# Altium schematic sheet Motortreiber.SchDoc
size A4; SheetNumber: 4; SheetTotal: 4
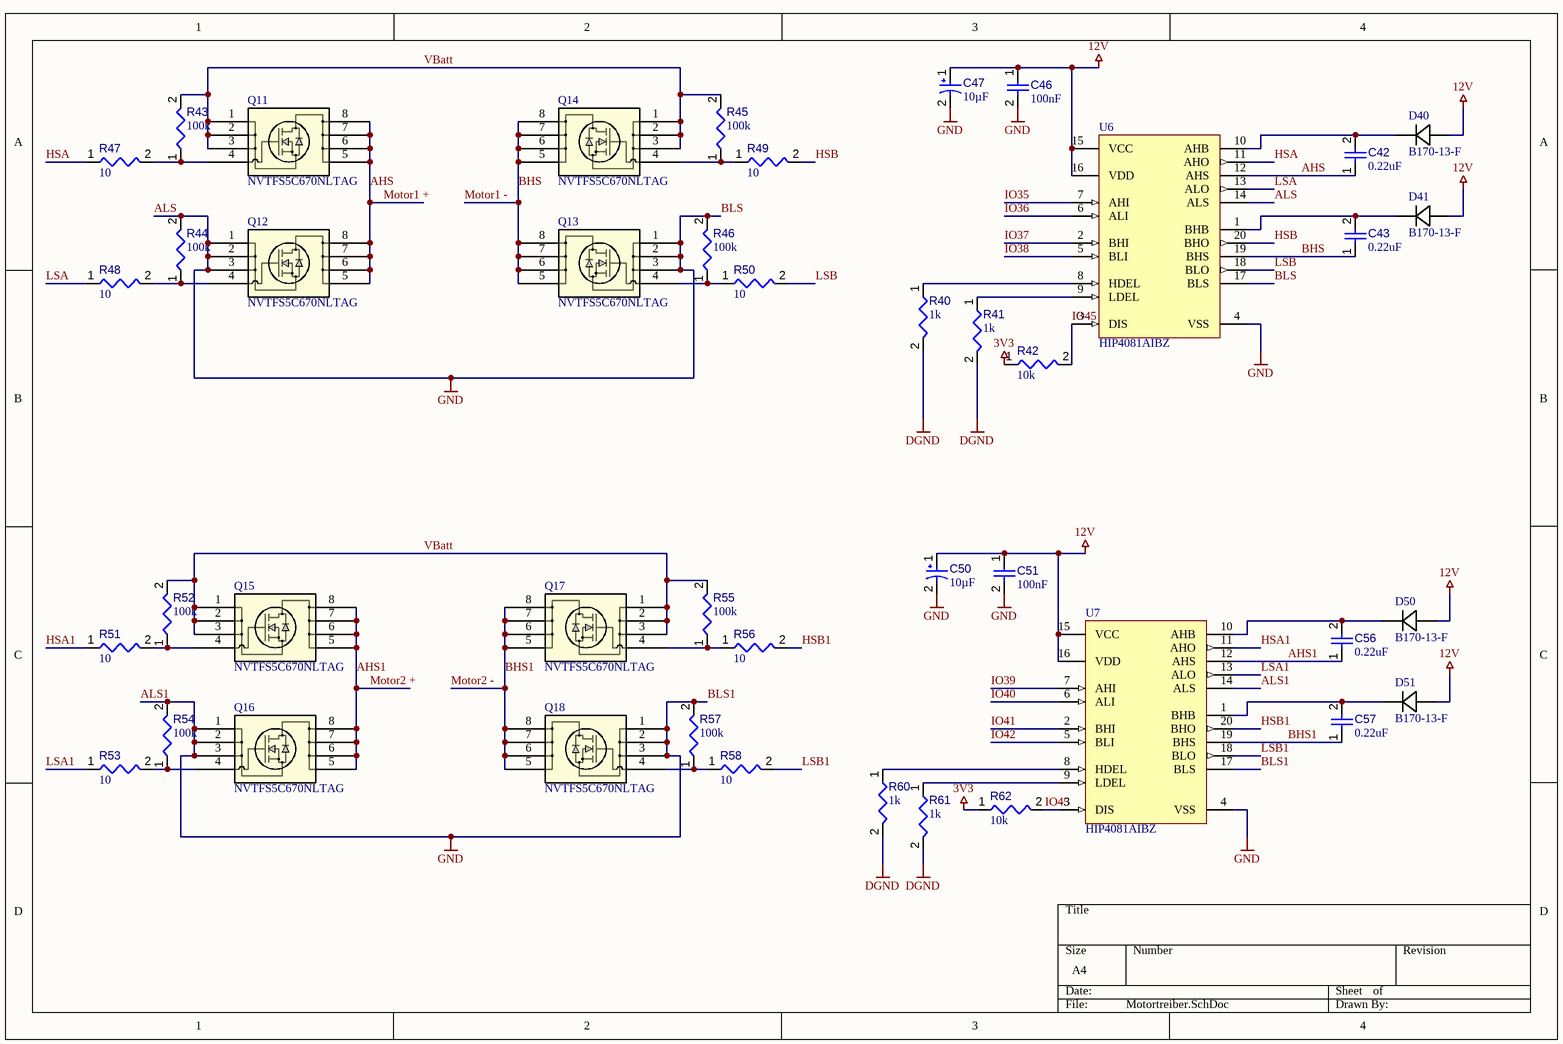
[diagram p0: Motortreiber.SchDoc]

## Parts
C42  value 0.22uF  [CAPC1608X90X40NL10T20]  (hidden comment: Capacitor 100 nF +/-10% 50 V 0603)
C43  value 0.22uF  [CAPC1608X90X40NL10T20]  (hidden comment: Capacitor 100 nF +/-10% 50 V 0603)
C46  value 100nF  [CAPC1608X90X40NL10T20]  (hidden comment: Capacitor 100 nF +/-10% 50 V 0603)
C47  value 10µF  [CAPPR55-200-1100X500X1200]  (hidden comment: ECA1HM100)
C50  value 10µF  [CAPPR55-200-1100X500X1200]  (hidden comment: ECA1HM100)
C51  value 100nF  [CAPC1608X90X40NL10T20]  (hidden comment: Capacitor 100 nF +/-10% 50 V 0603)
C56  value 0.22uF  [CAPC1608X90X40NL10T20]  (hidden comment: Capacitor 100 nF +/-10% 50 V 0603)
C57  value 0.22uF  [CAPC1608X90X40NL10T20]  (hidden comment: Capacitor 100 nF +/-10% 50 V 0603)
D40  B170-13-F  [SMA_DIO]
D41  B170-13-F  [SMA_DIO]
D50  B170-13-F  [SMA_DIO]
D51  B170-13-F  [SMA_DIO]
Q11  NVTFS5C670NLTAG  [WDFN8_511AB_ONS]
Q12  NVTFS5C670NLTAG  [WDFN8_511AB_ONS]
Q13  NVTFS5C670NLTAG  [WDFN8_511AB_ONS]
Q14  NVTFS5C670NLTAG  [WDFN8_511AB_ONS]
Q15  NVTFS5C670NLTAG  [WDFN8_511AB_ONS]
Q16  NVTFS5C670NLTAG  [WDFN8_511AB_ONS]
Q17  NVTFS5C670NLTAG  [WDFN8_511AB_ONS]
Q18  NVTFS5C670NLTAG  [WDFN8_511AB_ONS]
R40  value 1k  [RESC1608X55X25ML10T15]  (hidden comment: Resistor 1k +/-1% 0603 100 mW)
R41  value 1k  [RESC1608X55X25ML10T15]  (hidden comment: Resistor 1k +/-1% 0603 100 mW)
R42  value 10k  [RESC1608X55X25ML10T15]  (hidden comment: Resistor 10k +/-1% 0603 100 mW)
R43  value 100k  [RESC1608X55X25ML10T15]  (hidden comment: Resistor 100k +/-1% 0603 100 mW)
R44  value 100k  [RESC1608X55X25ML10T15]  (hidden comment: Resistor 100k +/-1% 0603 100 mW)
R45  value 100k  [RESC1608X55X25ML10T15]  (hidden comment: Resistor 100k +/-1% 0603 100 mW)
R46  value 100k  [RESC1608X55X25ML10T15]  (hidden comment: Resistor 100k +/-1% 0603 100 mW)
R47  value 10  [RESC1608X55X25ML10T15]  (hidden comment: Resistor 100k +/-1% 0603 100 mW)
R48  value 10  [RESC1608X55X25ML10T15]  (hidden comment: Resistor 100k +/-1% 0603 100 mW)
R49  value 10  [RESC1608X55X25ML10T15]  (hidden comment: Resistor 100k +/-1% 0603 100 mW)
R50  value 10  [RESC1608X55X25ML10T15]  (hidden comment: Resistor 100k +/-1% 0603 100 mW)
R51  value 10  [RESC1608X55X25ML10T15]  (hidden comment: Resistor 100k +/-1% 0603 100 mW)
R52  value 100k  [RESC1608X55X25ML10T15]  (hidden comment: Resistor 100k +/-1% 0603 100 mW)
R53  value 10  [RESC1608X55X25ML10T15]  (hidden comment: Resistor 100k +/-1% 0603 100 mW)
R54  value 100k  [RESC1608X55X25ML10T15]  (hidden comment: Resistor 100k +/-1% 0603 100 mW)
R55  value 100k  [RESC1608X55X25ML10T15]  (hidden comment: Resistor 100k +/-1% 0603 100 mW)
R56  value 10  [RESC1608X55X25ML10T15]  (hidden comment: Resistor 100k +/-1% 0603 100 mW)
R57  value 100k  [RESC1608X55X25ML10T15]  (hidden comment: Resistor 100k +/-1% 0603 100 mW)
R58  value 10  [RESC1608X55X25ML10T15]  (hidden comment: Resistor 100k +/-1% 0603 100 mW)
R60  value 1k  [RESC1608X55X25ML10T15]  (hidden comment: Resistor 1k +/-1% 0603 100 mW)
R61  value 1k  [RESC1608X55X25ML10T15]  (hidden comment: Resistor 1k +/-1% 0603 100 mW)
R62  value 10k  [RESC1608X55X25ML10T15]  (hidden comment: Resistor 10k +/-1% 0603 100 mW)
U6  HIP4081AIBZ  [M20_3_MFG]
U7  HIP4081AIBZ  [M20_3_MFG]

## Nets
3V3: R42.1 R62.1
12V: C46.1 C47.1 C50.1 C51.1 D40.2 D41.2 D50.2 D51.2 U6.15(VCC) U6.16(VDD) U7.15(VCC) U7.16(VDD)
ALS: C46.2 C47.2 C50.2 C51.2 Q12.1 Q12.2 Q12.3 Q13.1 Q13.2 Q13.3 Q16.1 Q16.2 Q16.3 Q18.1 Q18.2 Q18.3 R44.2 R46.2 R54.2 R57.2 U6.4(VSS) U6.14(ALS) U6.17(BLS) U7.4(VSS) U7.14(ALS) U7.17(BLS)  [also labelled ALS1, BLS, BLS1, GND]
DGND: R40.2 R41.2 R60.2 R61.2
AHS: C42.1 Q11.5 Q11.6 Q11.7 Q11.8 Q12.5 Q12.6 Q12.7 Q12.8 U6.12(AHS)  [also labelled Motor1 +]
AHS1: C56.1 Q15.5 Q15.6 Q15.7 Q15.8 Q16.5 Q16.6 Q16.7 Q16.8 U7.12(AHS)  [also labelled Motor2 +]
BHS: C43.1 Q13.5 Q13.6 Q13.7 Q13.8 Q14.5 Q14.6 Q14.7 Q14.8 U6.19(BHS)  [also labelled Motor1 -]
BHS1: C57.1 Q17.5 Q17.6 Q17.7 Q17.8 Q18.5 Q18.6 Q18.7 Q18.8 U7.19(BHS)  [also labelled Motor2 -]
HSA: R47.1 U6.11(AHO)
HSA1: R51.1 U7.11(AHO)
HSB: R49.2 U6.20(BHO)
HSB1: R56.2 U7.20(BHO)
IO35: U6.7(AHI)
IO36: U6.6(ALI)
IO37: U6.2(BHI)
IO38: U6.5(BLI)
IO39: U7.7(AHI)
IO40: U7.6(ALI)
IO41: U7.2(BHI)
IO42: U7.5(BLI)
IO45: R42.2 R62.2 U6.3(DIS) U7.3(DIS)
LSA: R48.1 U6.13(ALO)
LSA1: R53.1 U7.13(ALO)
LSB: R50.2 U6.18(BLO)
LSB1: R58.2 U7.18(BLO)
VBatt: Q11.1 Q11.2 Q11.3 Q14.1 Q14.2 Q14.3 Q15.1 Q15.2 Q15.3 Q17.1 Q17.2 Q17.3 R43.2 R45.2 R52.2 R55.2
NetC42_2: C42.2 D40.1 U6.10(AHB)
NetC43_2: C43.2 D41.1 U6.1(BHB)
NetC56_2: C56.2 D50.1 U7.10(AHB)
NetC57_2: C57.2 D51.1 U7.1(BHB)
NetQ11_4: Q11.4 R43.1 R47.2
NetQ12_4: Q12.4 R44.1 R48.2
NetQ13_4: Q13.4 R46.1 R50.1
NetQ14_4: Q14.4 R45.1 R49.1
NetQ15_4: Q15.4 R51.2 R52.1
NetQ16_4: Q16.4 R53.2 R54.1
NetQ17_4: Q17.4 R55.1 R56.1
NetQ18_4: Q18.4 R57.1 R58.1
NetR40_1: R40.1 U6.8(HDEL)
NetR41_1: R41.1 U6.9(LDEL)
NetR60_1: R60.1 U7.8(HDEL)
NetR61_1: R61.1 U7.9(LDEL)

## Library data of the parts
C42 C43 C46 C51 C56 C57 = CMP-001-00017-6: Chip Capacitor, 100 nF, +/- 10%, 50 V, 0603 (1608 Metric); Voltage Rating: 50V; Capacitor Type: Ceramic; Tolerance: 10%; Mounting Technology: SM; Max Operating Temperature: 125°C; RoHS Compliant: True; Pins: 2; Case/Package: 0603; Min Operating Temperature: -55°C
C47 C50 = CMP-001-00025-7: Aluminum Electrolytic Capacitor, 10 uF, +/- 20%, 50 V, -40 to 85 degC, 2-Pin THD, RoHS, Bulk; Manufacturer: Panasonic; Ripple Current (AC): 65mA; Voltage Rating: 50V; Mounting Technology: TH; RoHS Compliant: True; Capacitor Type: Electrolytic; Datasheet Version: Rev. 05, 10/2016; Min Operating Temperature: -40°C; Packaging: Bulk; Ripple Current: 65mA; Tolerance: 20%; Max Operating Temperature: 85°C; Datasheet URL: https://industrial.panasonic.com/cdbs/www-data/pdf/RDF0000/ABA0000C1218.pdf; Lead Pitch: 2mm; Pins: 2; Diameter: 5mm; Manufacturer URL: http://www.panasonic.com/; Package Reference: CAPPR55-200-1100X500X1200; Package Description: 2-Pin Radial Lead, Dia 5 mm, Height 12 mm; Case/Package: Radial; Package Quantity: 200
D40 D41 D50 D51 = B170-13-F: No Description Available; Manufacturer_Name: Diodes Inc; Copyright: Copyright (C) 2025 Ultra Librarian. All rights reserved.; Manufacturer_Part_Number: B170-13-F
Q11-Q18 = NVTFS5C670NLTAG: No Description Available; Manufacturer_Name: onsemi; Copyright: Copyright (C) 2025 Ultra Librarian. All rights reserved.; Manufacturer_Part_Number: NVTFS5C670NLTAG; RefDes: RefDes; Type: Type
R40 R41 R60 R61 = CMP-009-00014-5: Chip Resistor, 1 KOhm, +/-1%, 0.1 W, -55 to 155 degC, 0603 (1608 Metric); Voltage Rating: 50V; Power: 100mW; Tolerance: 1%; Mounting Technology: SM; Pins: 2; Case/Package: 0603; Min Operating Temperature: -55°C; RoHS Compliant: True; Max Operating Temperature: 155°C
R42 R62 = CMP-009-00017-5: Chip Resistor, 10 KOhm, +/- 1%, 01 W, -55 to 155 degC, 0603 (1608 Metric); Voltage Rating: 50V; Power: 100mW; RoHS Compliant: True; Min Operating Temperature: -55°C; Pins: 2; Case/Package: 0603; Mounting Technology: SM; Max Operating Temperature: 155°C; Tolerance: 1%
R43-R58 = CMP-009-00023-5: Chip Resistor, 100 KOhm, +/- 1%, 0.1 W, -55 to 155 degC, 0603 (1608 Metric); Voltage Rating: 50V; Power: 100mW; Max Operating Temperature: 155°C; RoHS Compliant: True; Tolerance: 1%; Pins: 2; Case/Package: 0603; Mounting Technology: SM; Min Operating Temperature: -55°C
U6 U7 = CMP-00572-88252432-3: Driver 2.5A 4-OUT Hi/Lo Side Full Brdg/Half Brdg Inv/Non-Inv Automotive 20-Pin SOIC W Tube; Manufacturer Lifecycle Status: ACTIVE; Fall Time: 10ns; Switching Frequency: 1MHz; Overload Protection: Under Voltage; Power Dissipation: 440mW; Number of Drivers: 4; Min Supply Voltage: 9.5V; Max Supply Voltage: 15V; Pitch: 1.3mm; Propagation Delay: 30ns; RAM Size: 32kB; Max Supply Current: 15.5mA; Output Voltage: 80V; Max Junction Temperature (Tj): 125°C; Rise Time: 10ns; ComponentLink1Description: Manufacturer's Website; ComponentLink2URL: https://octopart.com/cad-content/api/get-model-datasheet/15189/88252432; Max Power Dissipation: 440mW; REACH SVHC: No; Number of Outputs: 4; ComponentLink3URL: https://www.renesas.com/en/document/psc/package-drawing-soicw-20pin-m203?r=571616; Lifecycle Status: Production; Min Operating Temperature: -40°C; Export Control Classification Number (ECCN) Code: EAR99; Height: 0m; Max Output Current: 2.5A; Case/Package: SOIC; ComponentLink3Description: Manufacturer's Package Drawing; HelpURL: https://octopart.com/cad-content/api/get-model-datasheet/15189/88252432; ComponentLink1URL: http://www.renesas.com; ComponentLink2Description: Datasheet URL; Output Current: 2.5A; Packaging: Bulk; Width: 7.5mm; Number of Pins: 20; RoHS: Compliant; Mount: Surface Mount; Length: 12.9mm; Ambient Temperature Range High: 85°C; Max Operating Temperature: 85°C; Lead Free: Lead Free; Number of Channels: 4